# EAGLE schematic ATTAMI-Shield-Servo (EAGLE 7.1.0)
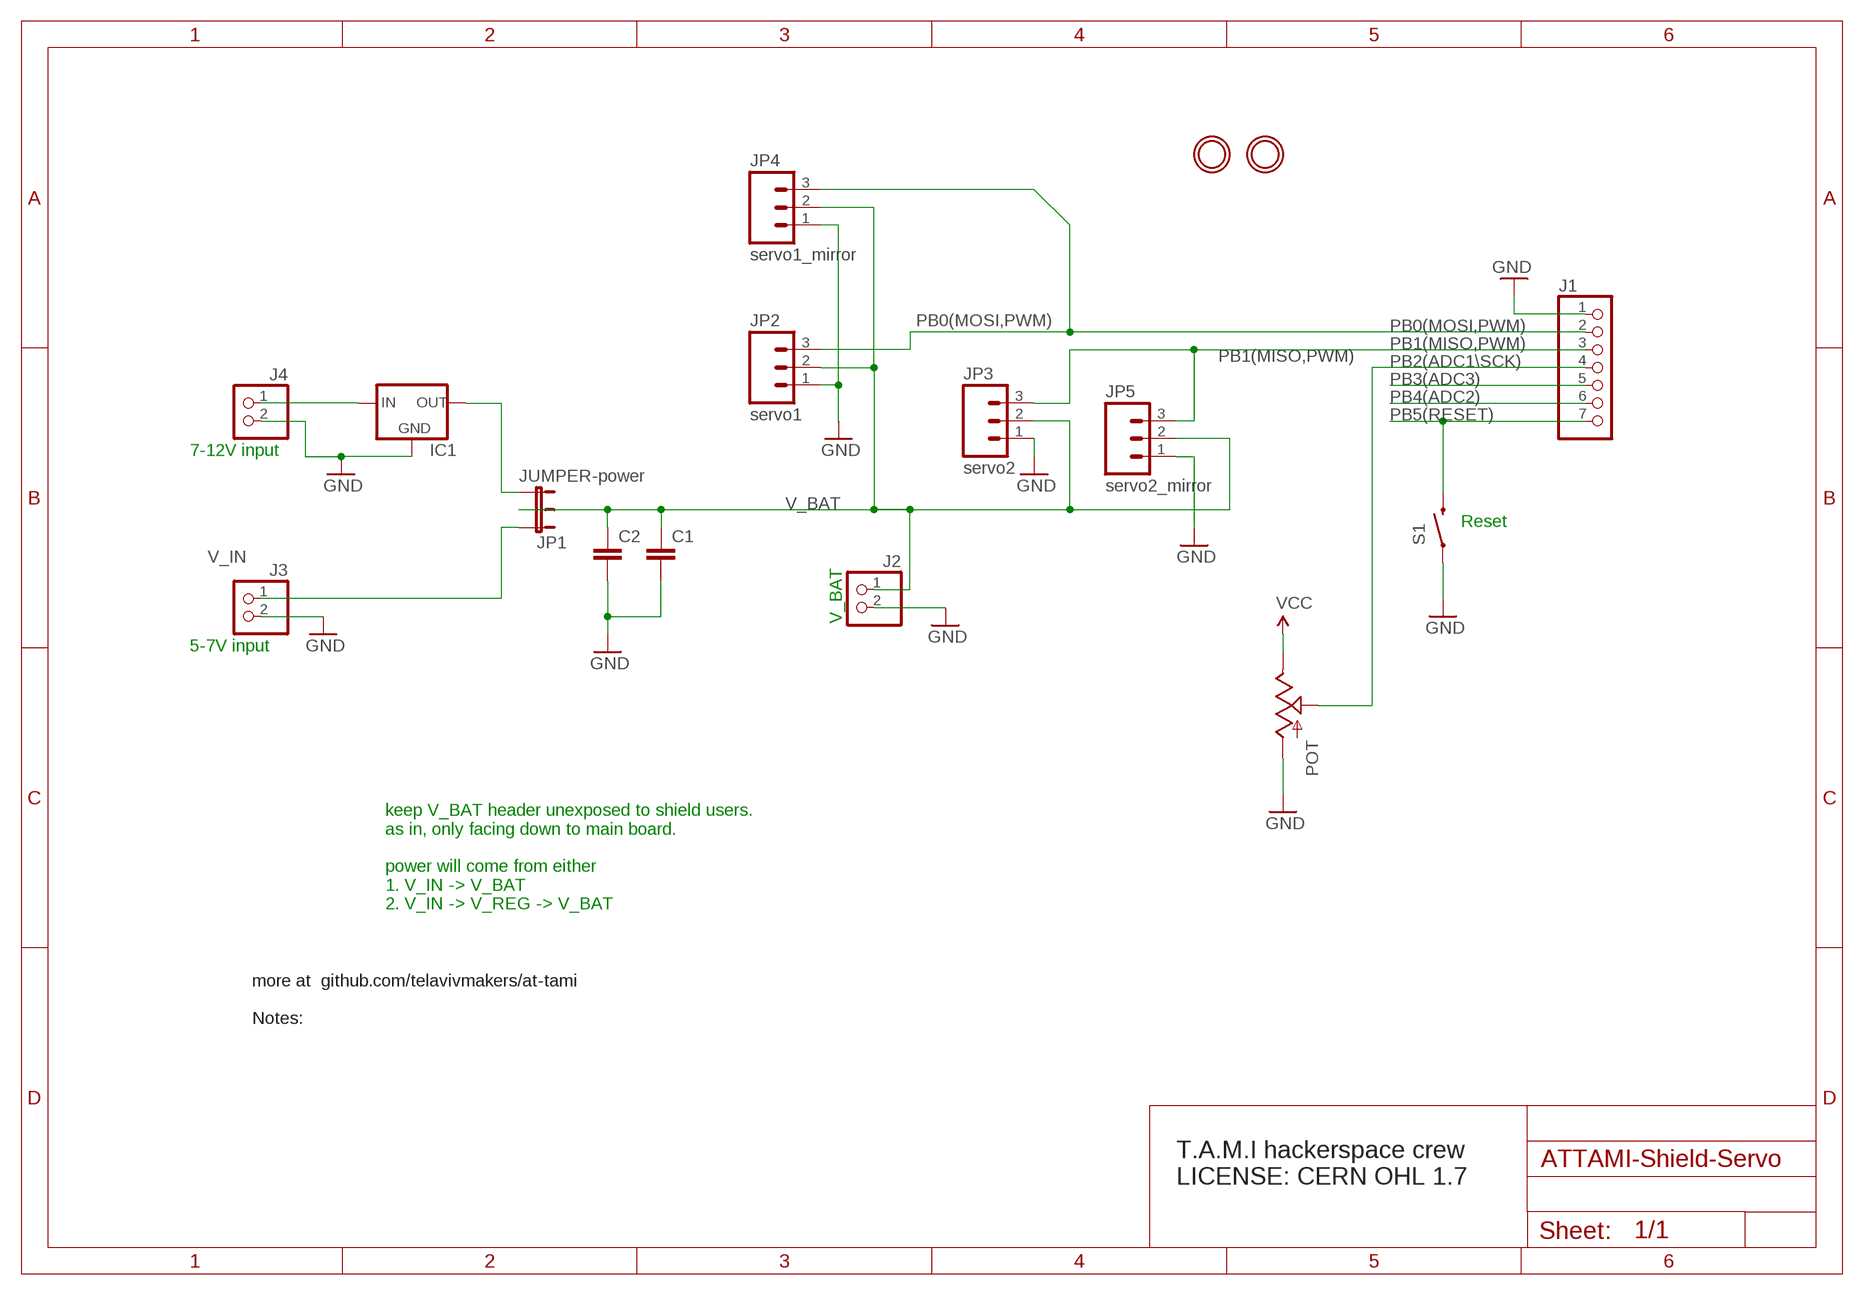
[diagram p0: schematic, sheet 1]

## Parts
C1  CAPKIT  [CAP-PTH-SMALL-KIT]
C2  CAPKIT  [CAP-PTH-SMALL-KIT]
IC1  V_REG_78XXSINK  [TO220-IGO]
J1  HEADER-1X7ROUND  [1X07_ROUND]
J2  HEADER-1X2ROUND  [1X02_ROUND]
J3  HEADER-1X2ROUND  [1X02_ROUND]
J4  HEADER-1X2ROUND  [1X02_ROUND]
JP1  JUMPER-power  JUMPER-3PTH  [1X03]
JP2  servo1  M03LONGPADS  [1X03_LONGPADS]
JP3  servo2  M03LONGPADS  [1X03_LONGPADS]
JP4  servo1_mirror  M03LONGPADS  [1X03_LONGPADS]
JP5  servo2_mirror  M03LONGPADS  [1X03_LONGPADS]
POT  POT100K_3362U  [3362U]
S1  SWITCH-MOMENTARY-2-SMD-1101NE  [TACTILE-SWITCH-1101NE]
U$1  MOUNTINGHOLE2.0  [MOUNTINGHOLE_2.0_PLATED]
U$2  MOUNTINGHOLE2.0  [MOUNTINGHOLE_2.0_PLATED]

## Nets
GND: C1.2 C2.2 IC1.GND J1.1 J2.2 J3.2 J4.2 JP2.1 JP3.1 JP4.1 JP5.1 POT.P$3(A) S1.P$1
N$1: IC1.IN J4.1
N$3: IC1.OUT JP1.3
PB0(MOSI,PWM): J1.2 JP2.3 JP4.3
PB1(MISO,PWM): J1.3 JP3.3 JP5.3
PB2(ADC1\SCK): J1.4 POT.P$2(S)
PB3(ADC3): J1.5
PB4(ADC2): J1.6
PB5(RESET): J1.7 S1.P$2
V_BAT: C1.1 C2.1 J2.1 JP1.2 JP2.2 JP3.2 JP4.2 JP5.2
V_IN: J3.1 JP1.1
VCC: POT.P$1(E)

## Notes on the sheet
- 7-12V input
- Reset
- V_BAT
- 5-7V input
- keep V_BAT header unexposed to shield users.
  as in, only facing down to main board.
  
  power will come from either 
  1. V_IN -> V_BAT
  2. V_IN -> V_REG -> V_BAT
- more at  github.com/telavivmakers/at-tami
  
  Notes:
- T.A.M.I hackerspace crew 
  LICENSE: CERN OHL 1.7

## Library data of the parts
C1 C2 = SparkFun-Capacitors:CAP: Capacitor Standard 0603 ceramic capacitor, and 0.1" leaded capacitor.
IC1 = SparkFun-PowerIC:V_REG_78XX: Voltage Regulator Standard 7805 5V regulator. IGO (Input Ground Output). Spark Fun Electronics SKU : COM-00107
J1 = microbuilder:HEADER-1X7: PIN HEADER
J2-J4 = microbuilder:HEADER-1X2: PIN HEADER
JP1 = SparkFun-Passives:JUMPER-3
JP2-JP5 = SparkFun-Connectors:M03: Header 3 Standard 3-pin 0.1" header. Use with straight break away headers (SKU : PRT-00116), right angle break away headers (PRT-00553), swiss pins (PRT-00743), machine pins (PRT-00117), and female headers (PRT-00115). Molex polarized connector foot print use with SKU : PRT-08232 with associated crimp pins and housings.
POT = SparkFun-Electromechanical:POT
S1 = SparkFun-Electromechanical:SWITCH-MOMENTARY-2: Various NO switches- pushbuttons, reed, etc
U$1 U$2 = microbuilder:MOUNTINGHOLE: Mounting Hole For #2 screws (0.086"/2.18mm width, 0.094"/2.4mm hole) use 2.5mm

## Net classes
0 default: width 0.203 mm
1 vcc: width 0.254 mm